# Altium schematic sheet LED_Driver.SchDoc
size A; DocumentNumber: 9; SheetNumber: 9; SheetTotal: 12
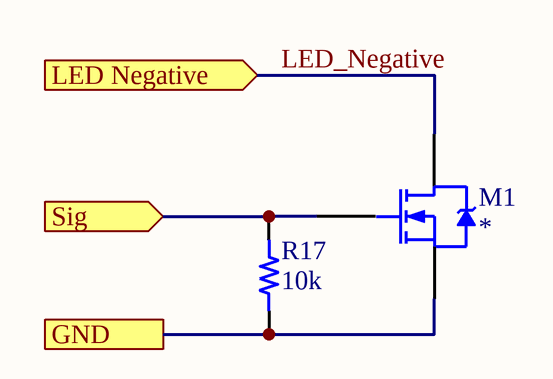
[diagram p0: LED_Driver.SchDoc]

## Parts
M1  *  [SOT23-3]
R17  10k  [RES 0603/1608]

## Ports
GND, LED Negative (in), Sig (in)

## Nets
GND: M1.2(S) R17.1 ; port GND
LED_Negative: M1.3(D) ; port LED Negative
Sig: M1.1(G) R17.2 ; port Sig

## Library data of the parts
M1 = 6: MOSFET N-CHANNEL 30V 5A SOT23; id: 6; vdsmax: 0; numcircuits: 1; current: 2.8A; rdson: 90mOhm; vt: 800; MfrPartNo: *; name: DMG2302UK-7; type: N_Channel; vgsmax: 1; package: SOT-23; quantity: 0; link: https://www.digikey.com/product-detail/en/diodes-incorporated/DMG2302UK-7/DMG2302UK-7DICT-ND/6010163
R17 = 1: id: 1; name: 0603 Resistor; percent tolerance: 5; resistance: 10k; package: 0603; quantity: 0